# Altium schematic sheet Analog_Input_Signal_Conditioning.SchDoc
size A4; CompanyName: Technische Hochschule Nürnberg Georg Simon Ohm; Organization: UltraZohm; Address1: Kesslerplatz 12; Address2: 90489 Nürnberg; Address3: GERMANY; DocumentNumber: 4; SheetNumber: 4; SheetTotal: 9; Website: www.ultrazohm.com
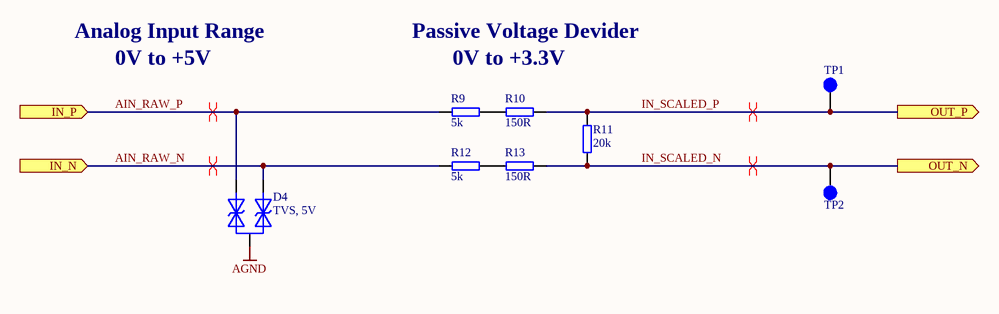
[diagram p0: Analog_Input_Signal_Conditioning.SchDoc]

## Parts
D4  TVS, 5V  [SOT-23-3]
R9  5k  [RES 0603_1608]
R10  150R  [RES 0603_1608]
R11  20k  [RES 0603_1608]
R12  5k  [RES 0603_1608]
R13  150R  [RES 0603_1608]
TP1  Testpoint 1mm  [TP_1mm]  (value not drawn)  (no BOM)
TP2  Testpoint 1mm  [TP_1mm]  (value not drawn)  (no BOM)

## Ports
IN_N (in), IN_P (in), OUT_N (out), OUT_P (out)

## Nets
AGND: D4.3(A)
AIN_RAW_N: D4.1(K1) R12.1 ; port IN_N
AIN_RAW_P: D4.2(K2) R9.1 ; port IN_P
IN_SCALED_N: R11.1 R13.2 TP2.1 ; port OUT_N
IN_SCALED_P: R10.2 R11.2 TP1.1 ; port OUT_P
NetR9_2: R9.2 R10.1
NetR12_2: R12.2 R13.1

## Layout directives
differential pair: AIN_RAW_N, AIN_RAW_P, IN_SCALED_N, IN_SCALED_P

## Notes on the sheet
- Analog Input Range
- 0V to +5V
- Passive Voltage Devider
- 0V to +3.3V
- Title
- Revision:
- Design Engineer:
- Date:
- Project:
- Sheet
- of

## Library data of the parts
D4 = SMC05: 2-Line Bi-directional TVS Diode Array; Manufacturer Part Number: SMC05; Manufacturer: Leditech; Type: TVS-Diode; Peak Impuls Current: 18 A; Power Dissipation: 300 W; Created from: AGeiger; PartID: 9; Created On: 30.08.2022 08:49:06; ComponentLink1Description: Datasheet; ComponentLink1URL: https://datasheet.lcsc.com/lcsc/1912111437_Leiditech-SMC05_C384879.pdf; Component Type: TVS Diode, ESD; Device Package: SOT-23-3; Last Updated: 30.08.2022 08:49:06; Mounting Type: SMD; Operating Temperature: -55 - 125°C; Series: SMC; Supplier 1: LCSC; Supplier Part Number 1: C384879; Value: TVS, 5V; Live Cycle Status: 1; LCSC Part Number: C384879
R9 R12 = RTT035001FTP: 1/10W Thick Film Resistors 75V ±1% ±100ppm/℃ -55℃~+155℃ 5kΩ; Manufacturer: RALEC; Created from: AGeiger; Manufacturer Part Number: RTT035001FTP; PartID: 237; Created On: 01.09.2022 12:32:42; ComponentLink1Description: Datasheet; ComponentLink1URL: https://datasheet.lcsc.com/lcsc/1912111437_RALEC-RTT035001FTP_C166926.pdf; Component Type: SMD resistor; Device Package: 0603; Last Updated: 01.09.2022 12:32:42; Mounting Type: SMD; Supplier 1: LCSC; Supplier Part Number 1: C166926; Type: Resistor; Tolerance: 1%; Value: 5k; Live Cycle Status: 1; LCSC Part Number: C166926
R10 R13 = 0603WAF1500T5E: 100mW Thick Film Resistors 75V ±100ppm/℃ ±1% -55℃~+155℃ 150Ω; Manufacturer: UNI-ROYAL; Created from: AGeiger; Manufacturer Part Number: 0603WAF1500T5E; PartID: 238; Created On: 01.09.2022 12:35:24; ComponentLink1Description: Datasheet; ComponentLink1URL: https://datasheet.lcsc.com/lcsc/2206010130_UNI-ROYAL-Uniroyal-Elec-0603WAF1500T5E_C22808.pdf; Component Type: SMD resistor; Device Package: 0603; Last Updated: 01.09.2022 12:35:24; Mounting Type: SMD; Supplier 1: LCSC; Supplier Part Number 1: C22808; Type: Resistor; Tolerance: 1%; Value: 150R; Live Cycle Status: 1; LCSC Part Number: C22808
R11 = 0603WAF2002T5E: SMD resistor E24 series; Manufacturer: UNI-ROYAL; Tolerance: 1%; Created from: AGeiger; Manufacturer Part Number: 0603WAF2002T5E; PartID: 105; Created On: 14.12.2020 16:17:14; ComponentLink1Description: Datasheet; ComponentLink1URL: https://datasheet.lcsc.com/lcsc/2206010230_UNI-ROYAL-Uniroyal-Elec-0603WAF2002T5E_C4184.pdf; Component Type: SMD resistor; Device Package: 0603; Last Updated: 25.08.2022 20:05:50; Mounting Type: SMD; Supplier 1: LCSC; Supplier Part Number 1: C4184; Type: Resistor; Value: 20k; Live Cycle Status: 1; Stock number: Labor SMD Container; LCSC Part Number: C4184
TP1 TP2 = NULL: Manufacturer Part Number: NULL; Created from: AGeiger; Created: 2018_06_25_AGeiger; Value: Testpoint 1mm; PartID: 9; Created On: 20.09.2022 13:14:57; Component Type: Testpoint; Last Updated: 20.09.2022 13:15:39; Manufacturer: NULL; Supplier 1: NULL; Supplier Part Number 1: NULL; Type: Testpoint; Live Cycle Status: 1